# Altium schematic sheet Microcontroller.SchDoc
size A3
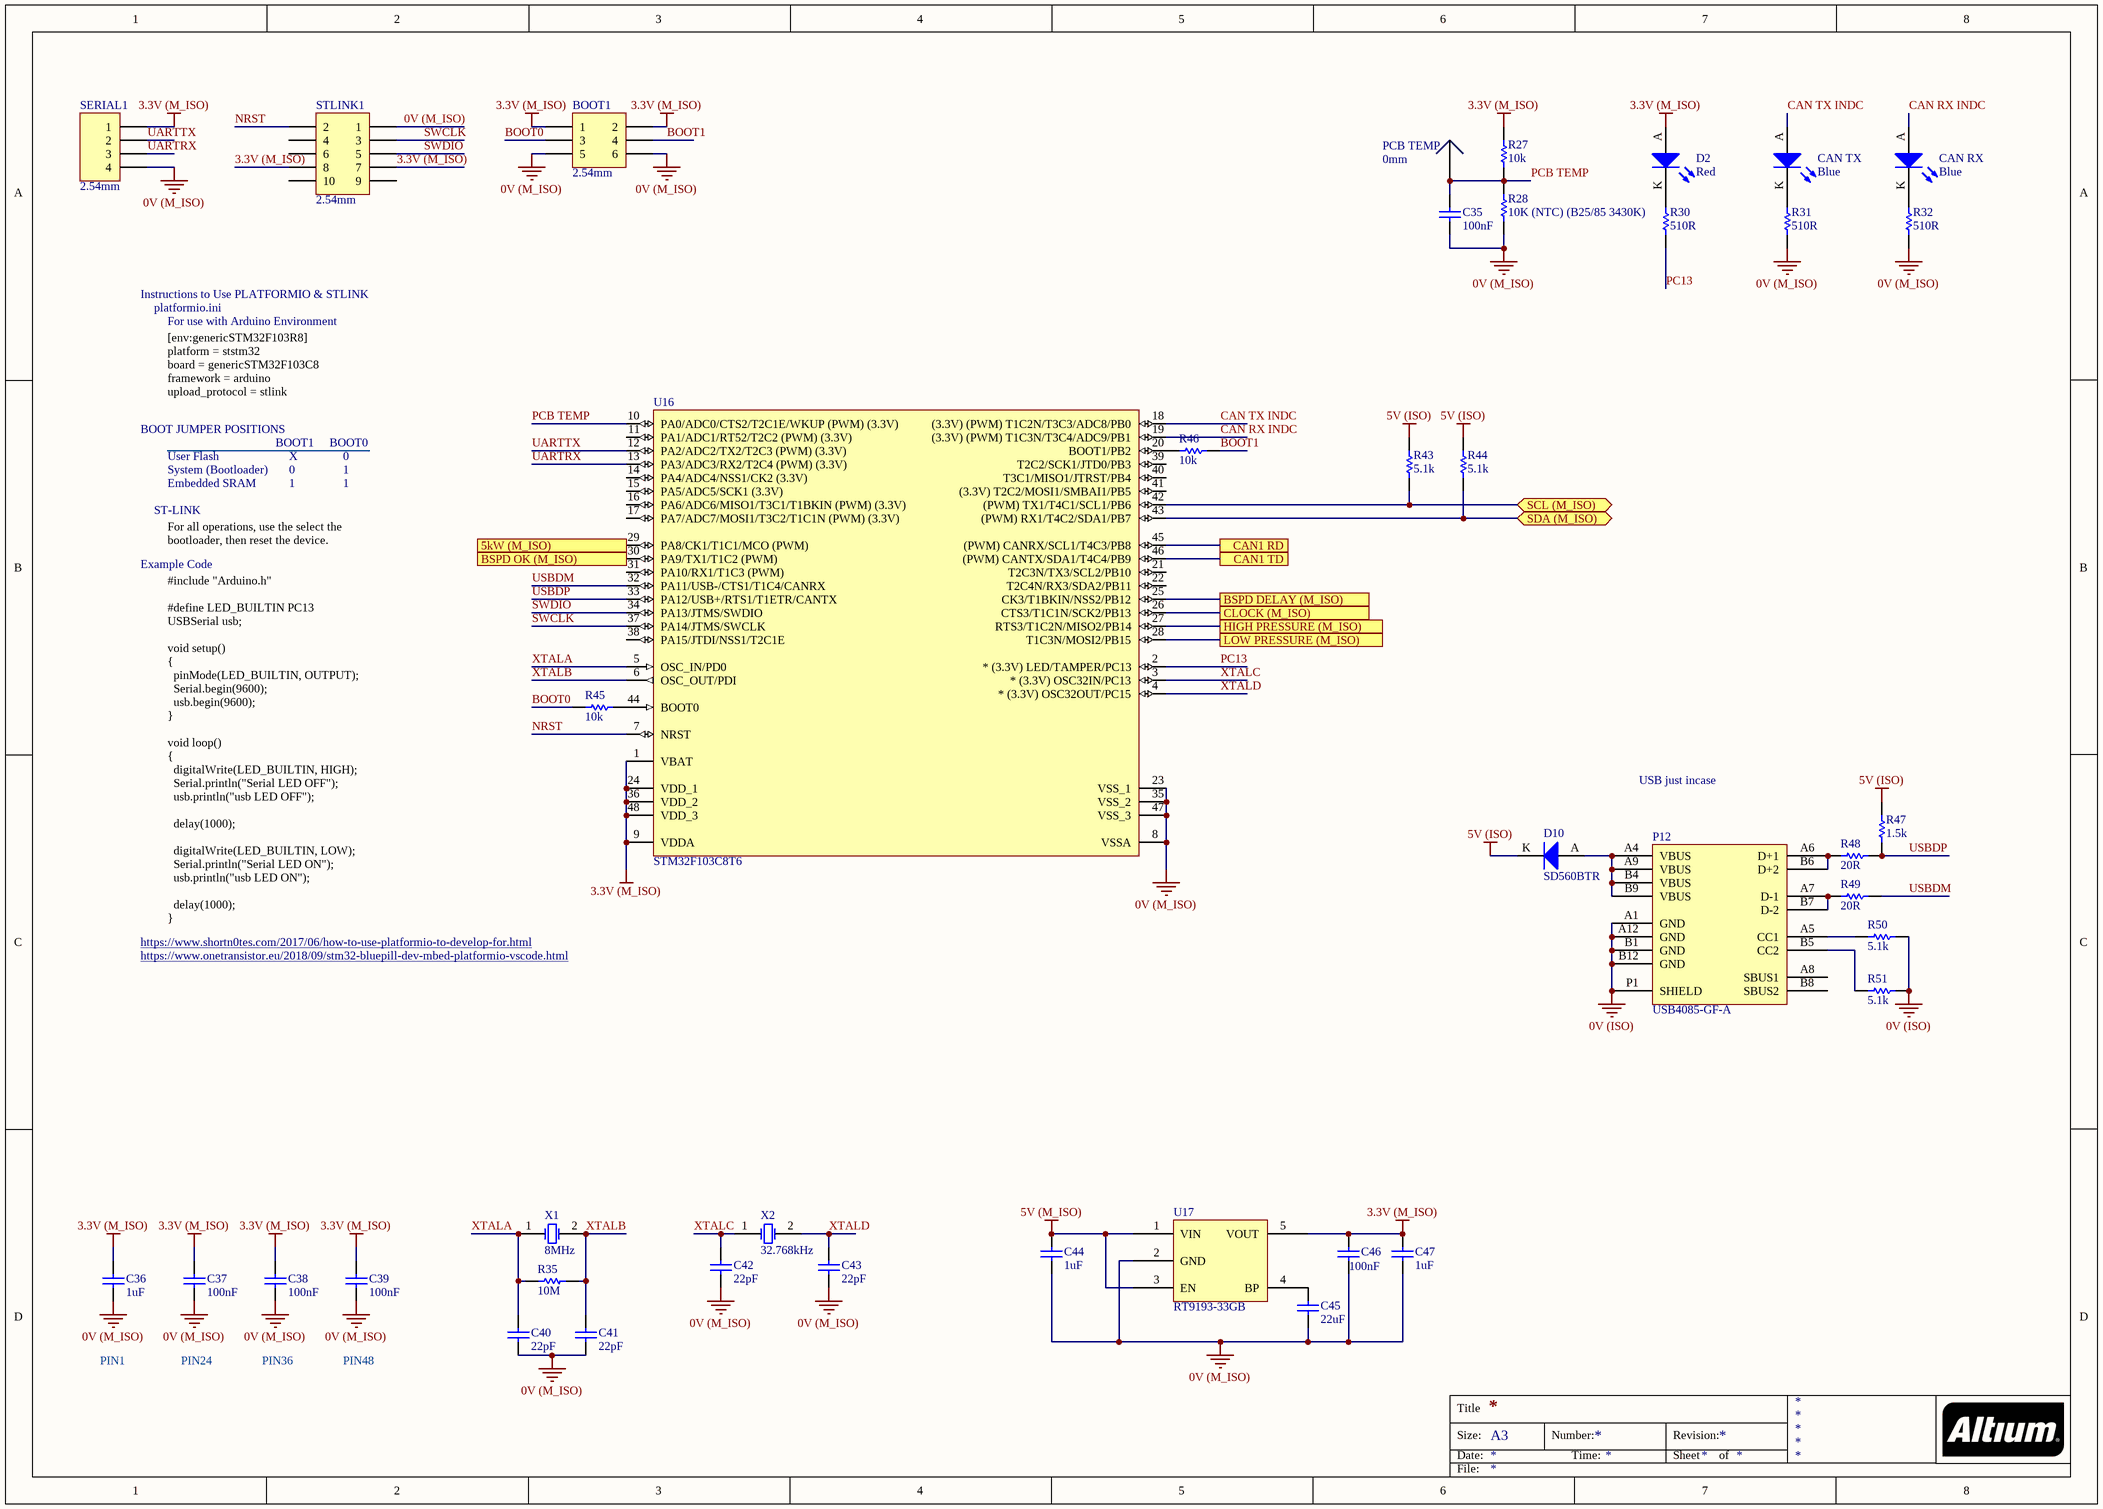
[diagram p0: Microcontroller.SchDoc]

## Parts
BOOT1  2.54mm  [TH 2.54mm Header 2x3]
C35  100nF  [0805]
C36  1uF  [0805]
C37  100nF  [0805]
C38  100nF  [0805]
C39  100nF  [0805]
C40  22pF  [0805]
C41  22pF  [0805]
C42  22pF  [0805]
C43  22pF  [0805]
C44  1uF  [0805]
C45  22uF  [0805]
C46  100nF  [0805]
C47  1uF  [0805]
CAN_RX  Blue  [0805 LED]
CAN_TX  Blue  [0805 LED]
D2  Red  [0805 LED]
D10  SD560BTR  [SMB Diode]
P12  USB4085-GF-A  [USB4085-GF-A]
PCB_TEMP  0mm  [SMD Test Point]
R27  10k  [0805]
R28  10K (NTC) (B25/85 3430K)  [0805]
R30  510R  [0805]
R31  510R  [0805]
R32  510R  [0805]
R35  10M  [0805]
R43  5.1k  [0805]
R44  5.1k  [0805]
R45  10k  [0805]
R46  10k  [0805]
R47  1.5k  [0805]
R48  20R  [0805]
R49  20R  [0805]
R50  5.1k  [0805]
R51  5.1k  [0805]
SERIAL1  2.54mm  [TH 2.54mm Header 1x4]
STLINK1  2.54mm  [TH 2.54mm Header 2x5]
U16  STM32F103C8T6  [STM 48-LQFP]
U17  RT9193-33GB  [RICHTEK SOT-23-5]
X1  8MHz  [Abracon HC-49/US]
X2  32.768kHz  [EPSON 2-SMD]

## Ports
5kW (M_ISO), BSPD DELAY (M_ISO), BSPD OK (M_ISO), CAN1 RD, CAN1 TD, CLOCK (M_ISO), HIGH PRESSURE (M_ISO), LOW PRESSURE (M_ISO), SCL (M_ISO) (bidir), SDA (M_ISO) (bidir)

## Nets
0V (ISO): P12.A1(GND) P12.A12(GND) P12.B1(GND) P12.B12(GND) P12.P1(SHIELD) R50.2 R51.2
0V (M_ISO): BOOT1.5 BOOT1.6 C35.1 C36.1 C37.1 C38.1 C39.1 C40.1 C41.1 C42.1 C43.1 C44.1 C45.1 C46.1 C47.1 R28.1 R31.1 R32.1 SERIAL1.4 STLINK1.1 U16.8(VSSA) U16.23(VSS_1) U16.35(VSS_2) U16.47(VSS_3) U17.2(GND)
3.3V (M_ISO): BOOT1.1 BOOT1.2 C36.2 C37.2 C38.2 C39.2 C46.2 C47.2 D2.A R27.2 SERIAL1.1 STLINK1.7 STLINK1.8 U16.1(VBAT) U16.9(VDDA) U16.24(VDD_1) U16.36(VDD_2) U16.48(VDD_3) U17.5(VOUT)
5V (ISO): D10.K R43.2 R44.2 R47.2
5V (M_ISO): C44.2 U17.1(VIN) U17.3(EN)
5kW (M_ISO): U16.29(PA8/CK1/T1C1/MCO_(PWM)) ; port 5kW (M_ISO)
BOOT0: BOOT1.3 R45.1
BOOT1: BOOT1.4 R46.2
BSPD DELAY (M_ISO): U16.25(CK3/T1BKIN/NSS2/PB12) ; port BSPD DELAY (M_ISO)
BSPD OK (M_ISO): U16.30(PA9/TX1/T1C2_(PWM)) ; port BSPD OK (M_ISO)
CAN1 RD: U16.45((PWM)_CANRX/SCL1/T4C3/PB8) ; port CAN1 RD
CAN1 TD: U16.46((PWM)_CANTX/SDA1/T4C4/PB9) ; port CAN1 TD
CAN RX INDC: CAN_RX.A U16.19((3.3V)_(PWM)_T1C3N/T3C4/ADC9/PB1)
CAN TX INDC: CAN_TX.A U16.18((3.3V)_(PWM)_T1C2N/T3C3/ADC8/PB0)
CLOCK (M_ISO): U16.26(CTS3/T1C1N/SCK2/PB13) ; port CLOCK (M_ISO)
HIGH PRESSURE (M_ISO): U16.27(RTS3/T1C2N/MISO2/PB14) ; port HIGH PRESSURE (M_ISO)
LOW PRESSURE (M_ISO): U16.28(T1C3N/MOSI2/PB15) ; port LOW PRESSURE (M_ISO)
NRST: STLINK1.2 U16.7(NRST)
PC13: R30.1 U16.2(*_(3.3V)_LED/TAMPER/PC13)
PCB TEMP: C35.2 PCB_TEMP.1 R27.1 R28.2 U16.10(PA0/ADC0/CTS2/T2C1E/WKUP_(PWM)_(3.3V))
SCL (M_ISO): R43.1 U16.42((PWM)_TX1/T4C1/SCL1/PB6) ; port SCL (M_ISO)
SDA (M_ISO): R44.1 U16.43((PWM)_RX1/T4C2/SDA1/PB7) ; port SDA (M_ISO)
SWCLK: STLINK1.3 U16.37(PA14/JTMS/SWCLK)
SWDIO: STLINK1.5 U16.34(PA13/JTMS/SWDIO)
UARTRX: SERIAL1.3 U16.13(PA3/ADC3/RX2/T2C4_(PWM)_(3.3V))
UARTTX: SERIAL1.2 U16.12(PA2/ADC2/TX2/T2C3_(PWM)_(3.3V))
USBDM: R49.2 U16.32(PA11/USB-/CTS1/T1C4/CANRX)
USBDP: R47.1 R48.2 U16.33(PA12/USB+/RTS1/T1ETR/CANTX)
XTALA: C40.2 R35.1 U16.5(OSC_IN/PD0) X1.1(OSC1)
XTALB: C41.2 R35.2 U16.6(OSC_OUT/PDI) X1.2(OSC2)
XTALC: C42.2 U16.3(*_(3.3V)_OSC32IN/PC13) X2.1(OSC1)
XTALD: C43.2 U16.4(*_(3.3V)_OSC32OUT/PC15) X2.2(OSC2)
NetC45_2: C45.2 U17.4(BP)
NetCAN_RX_K: CAN_RX.K R32.2
NetCAN_TX_K: CAN_TX.K R31.2
NetD2_K: D2.K R30.2
NetD10_A: D10.A P12.A4(VBUS) P12.A9(VBUS) P12.B4(VBUS) P12.B9(VBUS)
NetP12_A5: P12.A5(CC1) R50.1
NetP12_A6: P12.A6(D+1) P12.B6(D+2) R48.1
NetP12_A7: P12.A7(D-1) P12.B7(D-2) R49.1
NetP12_B5: P12.B5(CC2) R51.1
NetR45_2: R45.2 U16.44(BOOT0)
NetR46_1: R46.1 U16.20(BOOT1/PB2)

Not connected (* = marked no-connect by the designer): P12 A8(SBUS1) B8(SBUS2); STLINK1 4 6 9 10; U16 11(PA1/ADC1/RT52/T2C2_(PWM)_(3.3V)) 14(PA4/ADC4/NSS1/CK2_(3.3V)) 15(PA5/ADC5/SCK1_(3.3V)) 16(PA6/ADC6/MISO1/T3C1/T1BKIN_(PWM)_(3.3V)) 17(PA7/ADC7/MOSI1/T3C2/T1C1N_(PWM)_(3.3V)) 21(T2C3N/TX3/SCL2/PB10) 22(T2C4N/RX3/SDA2/PB11) 31(PA10/RX1/T1C3_(PWM)) 38(PA15/JTDI/NSS1/T2C1E) 39(T2C2/SCK1/JTD0/PB3) 40(T3C1/MISO1/JTRST/PB4) 41((3.3V)_T2C2/MOSI1/SMBAI1/PB5)

## Notes on the sheet
- Instructions to Use PLATFORMIO & STLINK
- platformio.ini
- For use with Arduino Environment
- BOOT JUMPER POSITIONS
- [env:genericSTM32F103R8]
  platform = ststm32
  board = genericSTM32F103C8
  framework = arduino
  upload_protocol = stlink
- BOOT1
- BOOT0
- ST-LINK
- User Flash
- System (Bootloader)
- Embedded SRAM
- X
- 1
- 0
- Example Code
- For all operations, use the select the bootloader, then reset the device.
- USB just incase
- #include "Arduino.h"
  #define LED_BUILTIN PC13
  USBSerial usb;
  void setup()
  {
  pinMode(LED_BUILTIN, OUTPUT);
  Serial.begin(9600);
  usb.begin(9600);
  }
  void loop()
  {
  digitalWrite(LED_BUILTIN, HIGH);
  Serial.println("Serial LED OFF");
  usb.println("usb LED OFF");
  delay(1000);
  digitalWrite(LED_BUILTIN, LOW);
  Serial.println("Serial LED ON");
  usb.println("usb LED ON");
  delay(1000);
  }
- https://www.shortn0tes.com/2017/06/how-to-use-platformio-to-develop-for.html
- https://www.onetransistor.eu/2018/09/stm32-bluepill-dev-mbed-platformio-vscode.html
- PIN1
- PIN24
- PIN36
- PIN48
- Title
- Size:
- Date:
- A3
- Number:
- Time:
- Revision:
- Sheet
- of
- File:

## Library data of the parts
BOOT1 = TH 2.54mm Header 2x3: Positions: 6; Angle: 0; Flange: No; Contact: NA; Part Number: TH 2.54mm Header 2x3; Pitch: 2.54mm; Row Spacing: 2.54mm
C35 C37-C39 C46 = GCM21BR71E104KA37L: Manufacturer: muRata; Tolerance: 10%; Material: X7R; Rated Voltage: 25V; Part Number: GCM21BR71E104KA37L; Value: 100nF
C36 C44 C47 = AC0805KKX7R8BB105: Manufacturer: YAGEO; Tolerance: 10%; Material: X7R; Rated Voltage: 25V; Part Number: AC0805KKX7R8BB105; Value: 1uF
C40-C43 = GCM21B5C1H220JA37L: Manufacturer: muRata; Tolerance: 5%; Material: C0G; Rated Voltage: 50V; Part Number: GCM21B5C1H220JA37L; Value: 22pF
C45 = GRM21BR61A226ME51L: Manufacturer: muRata; Tolerance: 20%; Material: X5R; Rated Voltage: 10V; Part Number: GRM21BR61A226ME51L; Value: 22uF; Digikey Part Number: 490-10511-1-ND
CAN_RX CAN_TX = SML-MN2BCTT86C: LED BLUE CLEAR 2012 SMD; Manufacturer: ROHM Semiconductor; Part Number: SML-MN2BCTT86C; Colour: Blue; Digikey Part Number: 846-1207-1-ND; Digikey Link: https://www.digikey.com/product-detail/en/rohm-semiconductor/SMLMN2BCTT86C/846-1207-1-ND/6057239
D2 = SML-210LTT86: Red LED Indication - Discrete 1.75V 0805 (2012 Metric); Manufacturer: ROHM Semiconductor; Part Number: SML-210LTT86; Colour: Red; Digikey Part Number: 511-1286-1-ND; Digikey Link: https://www.digikey.com/product-detail/en/rohm-semiconductor/SML-210LTT86/511-1286-1-ND/637099
D10 = SD560BTR: 1.2V_F 600V 5A SMB; Manufacturer: SMC Diode Solutions; Part Number: SD560BTR; Digikey Part Number: 1655-1530-2-ND; Digikey Link: https://www.digikey.com/product-detail/en/smc-diode-solutions/SD560BTR/1655-1530-2-ND/6022620
P12 = USB4085-GF-A: USB - C (Type - C) USB 2.0 Receptacle Connector 16 Position Through Hole, Right Angle; Angle: 90; Part Number: USB4085-GF-A; Digikey Part Number: 2073-USB4085-GF-ACT-ND; Digikey Link: https://www.digikey.ee/product-detail/en/gct/USB4085-GF-A/2073-USB4085-GF-ACT-ND/9859733
PCB_TEMP = SMD Test Point: Positions: 1; Row Spacing: 0; Flange: No; Contact: NA; Part Number: SMD Test Point; Pitch: 0mm; Angle: 0
R27 R45 R46 = RC0805FR0710KL: Manufacturer: YAGEO; Tolerance: 0.01; Rated Voltage: 0.125W; Part Number: RC0805FR0710KL; Value: 10k; Material: FR-07
R28 = NTCS0805E3103FLT: Manufacturer: Vishay Beyschlag; Tolerance: 0.01; Rated Voltage: 210mW; Part Number: NTCS0805E3103FLT; Value: 10K (NTC) (B25/85 3430K); Digikey Part Number: BC2733CT-ND
R30-R32 = RC0805FR07510RL: Manufacturer: YAGEO; Tolerance: 0.01; Rated Voltage: 0.125W; Part Number: RC0805FR07510RL; Value: 510R; Material: FR-07
R35 = RC0805FR0710ML: Manufacturer: YAGEO; Tolerance: 0.01; Rated Voltage: 0.125W; Part Number: RC0805FR0710ML; Value: 10M; Material: FR-07
R43 R44 R50 R51 = RC0805FR075K1L: Manufacturer: YAGEO; Tolerance: 0.01; Rated Voltage: 0.125W; Part Number: RC0805FR075K1L; Value: 5.1k; Material: FR-07
R47 = RC0805FR071K5L: Manufacturer: YAGEO; Tolerance: 0.01; Rated Voltage: 0.125W; Part Number: RC0805FR071K5L; Value: 1.5k; Material: FR-07
R48 R49 = RC0805FR0720RL: Manufacturer: YAGEO; Tolerance: 0.01; Rated Voltage: 0.125W; Part Number: RC0805FR0720RL; Value: 20R; Material: FR-07
SERIAL1 = TH 2.54mm Header 1x4: Positions: 4; Angle: 0; Flange: No; Contact: NA; Part Number: TH 2.54mm Header 1x4; Pitch: 2.54mm; Row Spacing: 2.54mm
STLINK1 = TH 2.54mm Header 2x5: Positions: 10; Angle: 0; Flange: No; Contact: NA; Part Number: TH 2.54mm Header 2x5; Pitch: 2.54mm; Row Spacing: 2.54mm
U16 = STM32F103C8T6: ARM® Cortex®-M3 STM32F1 Microcontroller IC 32-Bit 72MHz 64KB (64K x 8) FLASH; Manufacturer: STMicroelectronics; Part Number: STM32F103C8T6; Digikey Part Number: 497-6063-ND; Digikey Link: https://www.digikey.com/product-detail/en/stmicroelectronics/STM32F103C8T6/497-6063-ND/1646338
U17 = RT9193-33GB: IC REG LINEAR 3.3V 300MA SOT23-5; Manufacturer: Richtek; Part Number: RT9193-33GB; Digikey Part Number: 1028-1014-1-ND; Digikey Link: https://www.digikey.com/products/en?keywords=1028-1014-1-ND
X1 = ABLS-8.000MHZ-B4-T: Manufacturer: Abracon LLC; Load Capacitance: 18pF; ESR: 80R; Part Number: ABLS-8.000MHZ-B4-T; Value: 8MHz; Digikey Part Number: 535-10212-2-ND; Digikey Link: https://www.digikey.com/product-detail/en/abracon-llc/ABLS-8.000MHZ-B4-T/535-10212-2-ND/2184155
X2 = FC-135 32.7680KA-A5: Manufacturer: EPSON; Load Capacitance: 12.5pF; ESR: 70k; Part Number: FC-135 32.7680KA-A5; Value: 32.768kHz; Digikey Part Number: SER4103TR-ND; Digikey Link: https://www.digikey.com/product-detail/en/epson/FC-135-32.7680KA-A5/SER4103TR-ND/5259895